# EasyEDA schematic Схема EastPDA_New Project_2020-11-07_16-59-03.json
TITLE: Sheet_1; REV: 1.0; Date: 2020-11-07; Sheet: 1/1; Drawn By: Влад (lega); Company: Your Company
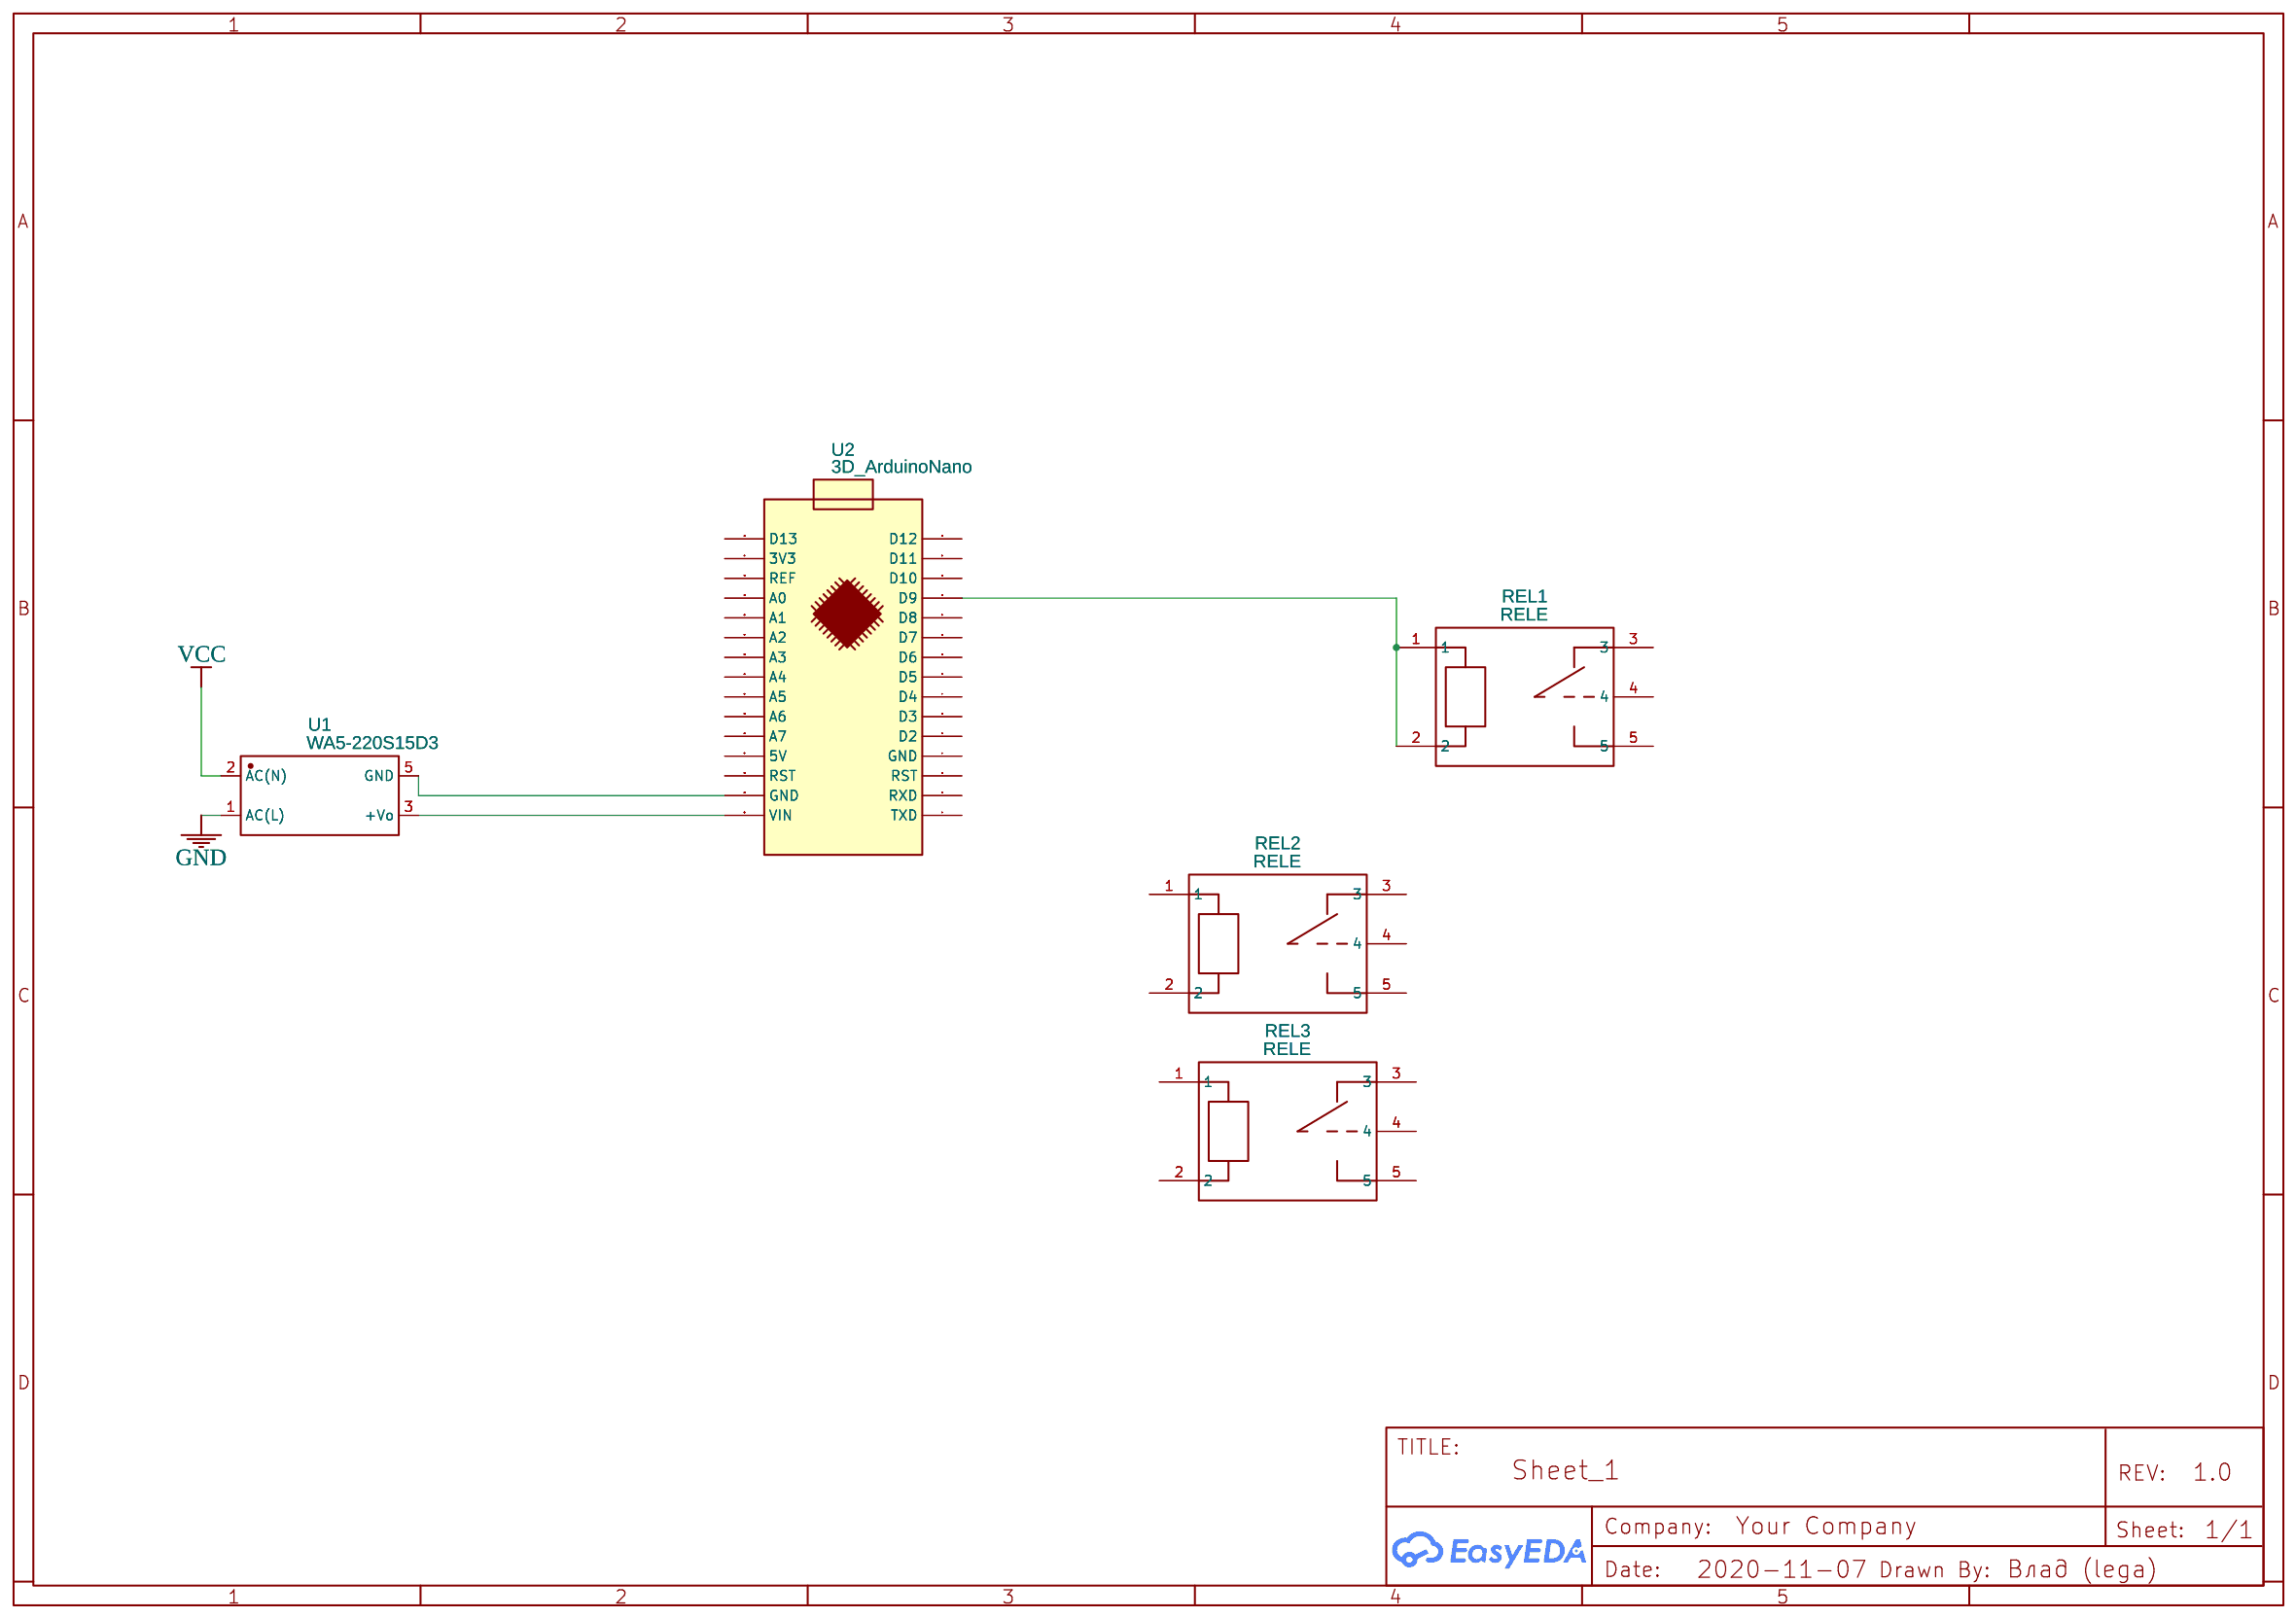
[diagram p0: schematic sheet]

## Parts
REL1  RELE  [RELE]
REL2  RELE  [RELE]
REL3  RELE  [RELE]
U1  WA5-220S15D3  [PWRM-TH_WA5-220SXXD3]
U2  3D_ArduinoNano  [ARDUINO NANO VINCENT]

## Library data of the parts
REL1-REL3 = RELE: Contributor: Banez; sourceId: nHd7oiAuM
U1 = WA5-220S15D3: Supplier: LCSC; Supplier Part: C135525; Manufacturer: Guangzhou Aipu Elec Tech; Contributor: LCSC
U2 = 3D_ArduinoNano: Manufacturer Part: ArduinoNano; Contributor: junlakan67

## Nets
GND: U1.1(AC(L))
VCC: U1.2(AC(N))
Net-(REL1-1): REL1.1 REL1.2 U2.12(D9)
Net-(U1-3): U1.3(+Vo) U2.30(VIN)
Net-(U1-5): U1.5(GND) U2.29(GND)

Not connected (* = marked no-connect by the designer): REL1 3 4 5; REL2 1 2 3 4 5; REL3 1 2 3 4 5; U2 1(TXD) 2(RXD) 3(RST) 4(GND) 5(D2) 6(D3) 7(D4) 8(D5) 9(D6) 10(D7) 11(D8) 13(D10) 14(D11) 15(D12) 16(D13) 17(3V3) 18(REF) 19(A0) 20(A1) 21(A2) 22(A3) 23(A4) 24(A5) 25(A6) 26(A7) 27(5V) 28(RST)
